# EAGLE design cms_intro (EAGLE 5.10)
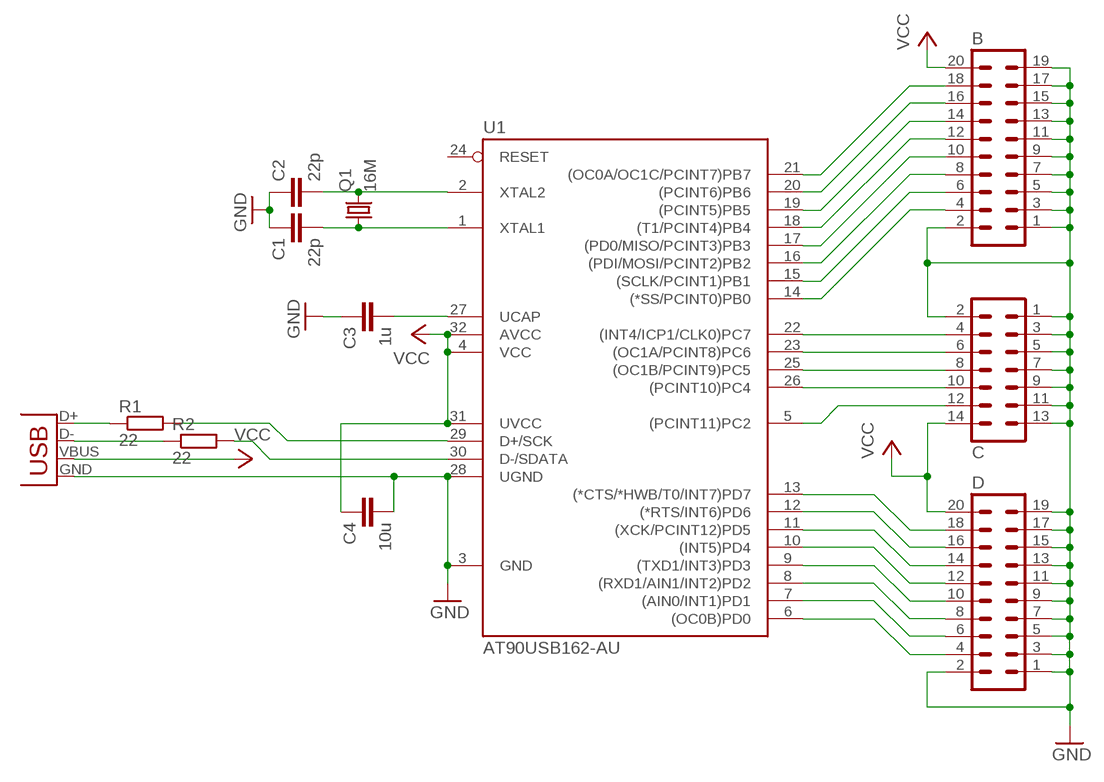
[diagram p0: schematic, sheet 1]

## Parts
B  MA10-2  [MA10-2]
C  MA07-2  [MA07-2]
C1  22p  C-EUC0603  [C0603]
C2  22p  C-EUC0603  [C0603]
C3  1u  C-EUC0603  [C0603]
C4  10u  C-EUC0603  [C0603]
D  MA10-2  [MA10-2]
Q1  16M  CRYSTALSM49  [SM49]
R1  22  R-EU_R0603  [R0603]
R2  22  R-EU_R0603  [R0603]
U1  AT90USB162-AU  [TQFP32-08]
X7  USB-MICROB-S  [USB-MICROB]

## Nets
B0: B.4 U1.14((*SS/PCINT0)PB0)
B1: B.6 U1.15((SCLK/PCINT1)PB1)
B2: B.8 U1.16((PDI/MOSI/PCINT2)PB2)
B3: B.10 U1.17((PD0/MISO/PCINT3)PB3)
B4: B.12 U1.18((T1/PCINT4)PB4)
B5: B.14 U1.19((PCINT5)PB5)
B6: B.16 U1.20((PCINT6)PB6)
B7: B.18 U1.21((OC0A/OC1C/PCINT7)PB7)
C2: C.12 U1.5((PCINT11)PC2)
C4: C.10 U1.26((PCINT10)PC4)
C5: C.8 U1.25((OC1B/PCINT9)PC5)
C6: C.6 U1.23((OC1A/PCINT8)PC6)
C7: C.4 U1.22((INT4/ICP1/CLK0)PC7)
D0: D.4 U1.6((OC0B)PD0)
D1: D.6 U1.7((AIN0/INT1)PD1)
D2: D.8 U1.8((RXD1/AIN1/INT2)PD2)
D3: D.10 U1.9((TXD1/INT3)PD3)
D4: D.12 U1.10((INT5)PD4)
D5: D.14 U1.11((XCK/PCINT12)PD5)
D6: D.16 U1.12((*RTS/INT6)PD6)
D7: D.18 U1.13((*CTS/*HWB/T0/INT7)PD7)
DM: R2.2 U1.30(D-/SDATA)
DMC: R2.1 X7.D-
DP: R1.2 U1.29(D+/SCK)
DPC: R1.1 X7.D+
GND [supply]: B.1 B.2 B.3 B.5 B.7 B.9 B.11 B.13 B.15 B.17 B.19 C1.1 C2.1 C3.1 C4.2 C.1 C.2 C.3 C.5 C.7 C.9 C.11 C.13 D.1 D.2 D.3 D.5 D.7 D.9 D.11 D.13 D.15 D.17 D.19 U1.3(GND) U1.28(UGND) X7.GND
UCAP: C3.2 U1.27(UCAP)
VCC [supply]: B.20 C4.1 C.14 D.20 U1.4(VCC) U1.31(UVCC) U1.32(AVCC) X7.VBUS
XTAL1: C1.2 Q1.1 U1.1(XTAL1)
XTAL2: C2.2 Q1.2 U1.2(XTAL2)
Unconnected: U1.24(RESET)

## Library data of the parts
B D = con-lstb:MA10-2: PIN HEADER
C = con-lstb:MA07-2: PIN HEADER
C1-C4 = rcl:C-EU: CAPACITOR, European symbol
Q1 = crystal:CRYSTAL: CRYSTAL
R1 R2 = rcl:R-EU_: RESISTOR, European symbol
U1 = at90usb:AT90USB162-*
X7 = apbteam_con-usb:USB: USB Connectors

## Net classes
1 supply: width 0.254 mm

## Board
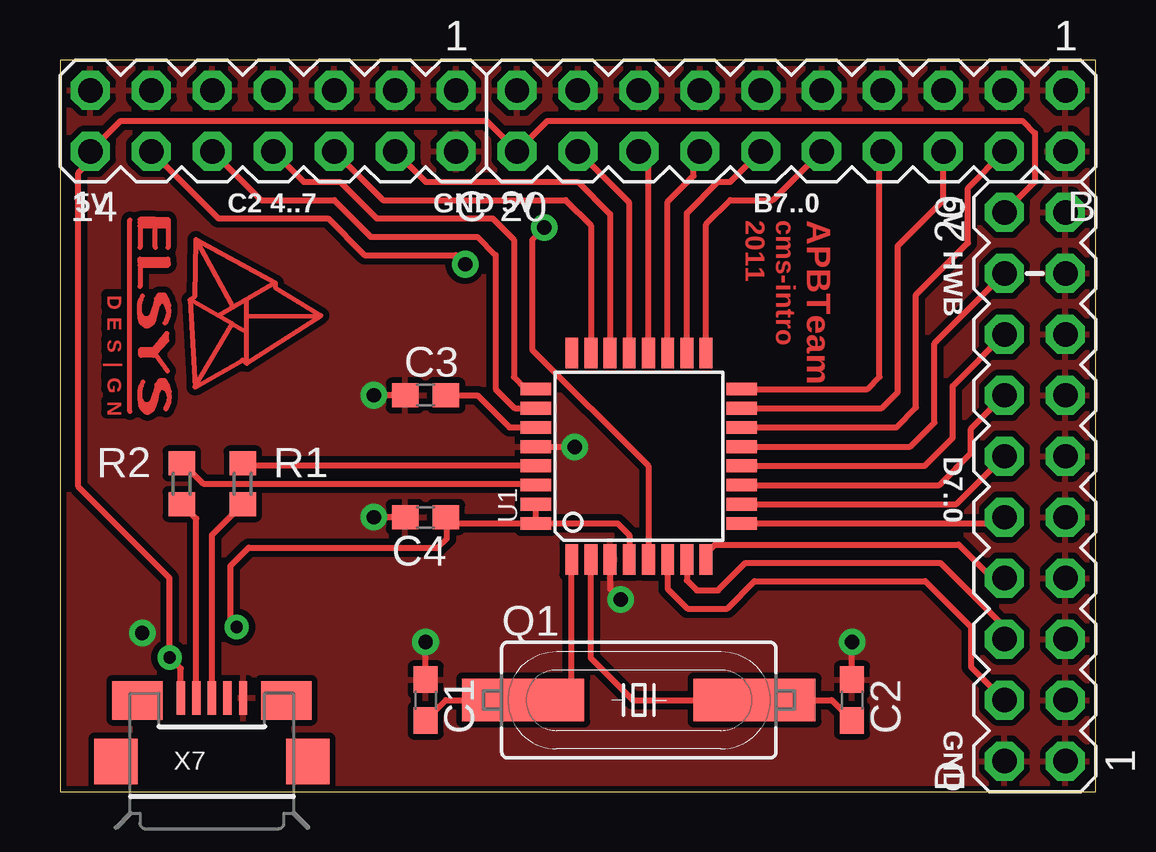
[diagram p1: board, top side]
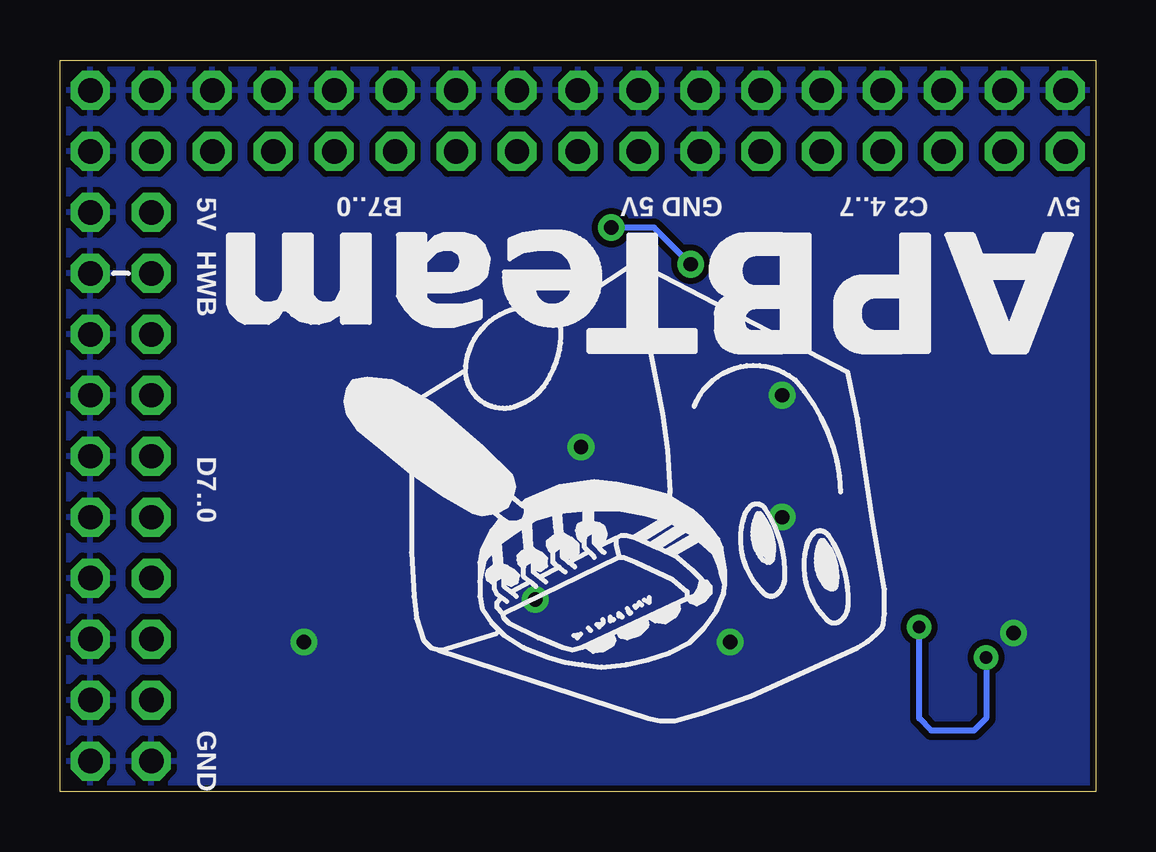
[diagram p2: board, bottom side, seen from below]

Size 43.18 x 30.48 mm. Coordinates in mm from the lower left corner, seen from the top.
Outline: 0,0 43.18,0 43.18,30.48 0,30.48 0,0
Copper layers (1*16): Top 0.035mm / dielectric 1.5mm / Bottom 0.035mm
Design rules "SparkFun *": minimum track width 6mil, minimum drill 20mil, track to track 6mil, track to pad 8mil, pad to pad 8mil, via to via 8mil, smd to smd 8mil, copper to edge 10mil, drill to drill 8mil, minimum pad ring 12mil, minimum via ring 10mil, stop-mask expansion 4mil, vias tented up to drill 25mil, thermal gap 10mil
tRestrict: area 3.3,0 to 9.4,2.7

### Footprints (pad centres in the part's own frame; a part is rotated, then mirrored left to right if it is on the bottom)
MA10-2 = drill 1.016 octagon: 1 -11.43,-1.27; 2 -11.43,1.27; 3 -8.89,-1.27; 4 -8.89,1.27; 5 -6.35,-1.27; 6 -6.35,1.27; 7 -3.81,-1.27; 8 -3.81,1.27; 9 -1.27,-1.27; 10 -1.27,1.27; 11 1.27,-1.27; 12 1.27,1.27; 13 3.81,-1.27; 14 3.81,1.27; 15 6.35,-1.27; 16 6.35,1.27; 17 8.89,-1.27; 18 8.89,1.27; 19 11.43,-1.27; 20 11.43,1.27
MA07-2 = drill 1.016 octagon: 1 -7.62,-1.27; 2 -7.62,1.27; 3 -5.08,-1.27; 4 -5.08,1.27; 5 -2.54,-1.27; 6 -2.54,1.27; 7 0,-1.27; 8 0,1.27; 9 2.54,-1.27; 10 2.54,1.27; 11 5.08,-1.27; 12 5.08,1.27; 13 7.62,-1.27; 14 7.62,1.27
C0603 = smd 1.1 x 1: 1 -0.85,0; 2 0.85,0
SM49 = smd 5.08 x 1.778: 1 -4.826,0; 2 4.826,0
R0603 = smd 1 x 1.1: 1 -0.85,0; 2 0.85,0
TQFP32-08 = smd 1.27 x 0.533: 1 -4.293,2.8; 2 -4.293,2; 3 -4.293,1.2; 4 -4.293,0.4; 5 -4.293,-0.4; 6 -4.293,-1.2; 7 -4.293,-2; 8 -4.293,-2.8; 17 4.293,-2.8; 18 4.293,-2; 19 4.293,-1.2; 20 4.293,-0.4; 21 4.293,0.4; 22 4.293,1.2; 23 4.293,2; 24 4.293,2.8 | smd 0.533 x 1.27: 9 -2.8,-4.293; 10 -2,-4.293; 11 -1.2,-4.293; 12 -0.4,-4.293; 13 0.4,-4.293; 14 1.2,-4.293; 15 2,-4.293; 16 2.8,-4.293; 25 2.8,4.293; 26 2,4.293; 27 1.2,4.293; 28 0.4,4.293; 29 -0.4,4.293; 30 -1.2,4.293; 31 -2,4.293; 32 -2.8,4.293
USB-MICROB = smd 0.35 x 1.4: D+ 0,2.65; D- -0.65,2.65; GND 1.3,2.65; ID 0.65,2.65; VBUS -1.3,2.65 | smd 1.8 x 1.9: MT1 -4,0; MT2 4,0 | smd 2.1 x 1.6: MT3 -3.1,2.55; MT4 3.1,2.55

### Placement (x,y rotation side)
B  30.48,27.94 180 top
C  8.89,27.94 180 top
C1  15.24,3.81 270 top
C2  33.02,3.81 270 top
C3  15.24,16.51 0 top
C4  15.24,11.43 180 top
D  40.64,12.7 90 top
Q1  24.13,3.81 0 top
R1  7.62,12.83 90 top
R2  5.08,12.83 90 top
U1  24.13,13.97 90 top
X7  6.33,1.25 0 top

### Tracks (layer width: path | path; a pad name or v marks a point on that pad's centre or on a via)
B0
  Top 0.254: U1.14 34.85,15.17 35.69,16 35.69,20.7 37.85,22.86 37.85,25.15 B.4
B1
  Top 0.254: U1.15 34.26,15.97 34.92,16.64 34.92,22.73 36.83,24.64 B.6
B2
  Top 0.254: U1.16 33.66,16.77 34.16,17.27 34.16,26.54 B.8
B3
  Top 0.254: U1.17 26.93,23.63 27.94,24.64 29.72,24.64 B.10
B4
  Top 0.254: U1.18 26.13,24.1 27.43,25.4 27.94,25.4 B.12
B5
  Top 0.254: U1.19 25.33,24.57 26.42,25.65 26.42,26.42 B.14
B6
  Top 0.254: U1.20 24.53,26.27 B.16
B7
  Top 0.254: U1.21 23.73,24.53 B.18
C2  (via drill 0.6)
  Top 0.254: U1.5 24.53,13.57 19.68,18.41 19.68,22.99 v20.19,23.5 | v16.89,21.97 16.51,22.35 12.7,22.35 11.18,23.88 6.6,23.88 C.12
  Bottom 0.254: v20.19,23.5 18.41,23.5 v16.89,21.97
C4
  Top 0.254: U1.26 18.95,15.97 18.16,16.76 18.16,22.35 17.4,23.11 12.95,23.11 11.43,24.64 8.38,24.64 C.10
C5
  Top 0.254: U1.25 19.43,16.77 18.92,17.27 18.92,22.99 18.03,23.88 13.21,23.88 11.68,25.4 10.16,25.4 C.8
C6
  Top 0.254: U1.23 22.13,23.59 21.08,24.64 13.46,24.64 C.6
C7
  Top 0.254: U1.22 22.93,24.06 21.59,25.4 15.24,25.4 C.4
D0
  Top 0.254: U1.6 25.33,8.45 26.16,7.62 27.81,7.62 28.96,8.76 36.07,8.76 37.97,6.86 37.97,5.21 D.4
D1
  Top 0.254: U1.7 26.13,8.79 26.54,8.38 27.43,8.38 28.57,9.53 36.7,9.53 39.37,6.86 D.6
D2
  Top 0.254: U1.8 26.93,9.91 27.3,10.29 37.47,10.29 38.86,8.89 D.8
D3
  Top 0.254: U1.9 39.11,11.17 D.10
D4
  Top 0.254: U1.10 37.37,11.97 D.12
D5
  Top 0.254: U1.11 36.65,12.77 37.97,14.1 37.97,15.11 D.14
D6
  Top 0.254: U1.12 36.05,13.57 37.21,14.73 37.21,16.89 D.16
D7
  Top 0.254: U1.13 35.45,14.37 36.45,15.37 36.45,18.67 D.18
DM
  Top 0.254: R2.2 5.12,13.68 5.97,12.83 19.78,12.83 U1.30
DMC
  Top 0.254: X7.D- 5.68,11.37 R2.1
DP
  Top 0.254: R1.2 7.79,13.68 7.87,13.59 19.82,13.59 U1.29
DPC
  Top 0.254: X7.D+ 6.33,10.69 R1.1
GND  (via drill 0.6)
  Top 0.254: C1.1 v15.24,6.22 | C2.1 v33.02,6.22 | U1.3 22.93,8.44 v23.37,8 | U1.28 21.44,14.37 v21.46,14.35 | C4.2 v13.08,11.43 | C3.1 v13.08,16.51
  other vias: 3.43,6.6
  pour Top (isolate 0.254): 0,30.48 43.18,30.48 43.18,0 0,0
  pour Bottom (isolate 0.254): 0,30.48 43.18,30.48 43.18,0 0,0
N$1
  Top 0.203: 8.98,21.2 6.64,19.85 | 5.68,23 8.98,21.2 | 8.98,21.2 8.98,20.99 10.88,19.82 | 7.79,17.84 7.79,19.8 | 7.79,19.8 7.79,20.51 | 7.79,17.84 10.88,19.82 | 7.79,17.84 7.61,17.97 5.63,16.85 5.42,20.48 | 7.18,19.49 7.76,19.16 | 7.18,19.49 5.42,20.48 | 5.42,20.48 5.63,20.64 5.68,23 | 5.68,23 7.23,20.18 | 7.79,19.8 10.88,19.82 | 5.63,16.88 7.18,19.49
N$2
  Top 0.203: 4.51,23.56 4.51,22.67 | 4.51,23.71 4.51,23.56 | 4.51,23.71 4.51,23.84 3.98,23.84 | 3.98,23.84 3.34,23.84 3.34,23.71 | 3.34,23.56 3.34,22.67 | 3.98,22.67 3.98,23.84 | 4.51,23.56 3.34,23.56 | 3.34,23.71 3.34,23.56 | 3.34,23.71 4.51,23.71
N$3
  Top 0.203: 3.34,22.06 3.34,22.19 4.51,22.19 4.51,22.06 | 3.34,21.93 3.34,21.04 | 4.51,22.06 4.51,21.93 3.34,21.93 | 3.34,22.06 3.34,21.93 | 3.34,22.06 4.51,22.06
N$4
  Top 0.203: 3.44,20.64 3.37,20.48 3.31,20.28 3.31,19.98 3.34,19.72 3.42,19.52 | 3.42,19.52 3.57,19.39 3.67,19.39 3.82,19.49 3.9,19.67 3.98,19.93 4.05,20.26 4.18,20.41 4.23,20.43 4.36,20.38 4.46,20.26 4.53,20.05 4.53,20 | 4.53,20 4.51,19.82 4.38,19.52 | 4.08,20.61 4.13,20.69 4.36,20.69 4.46,20.51 4.53,20.26 4.53,20 | 4.08,20.61 4.03,20.54 3.95,20.21 3.82,19.82 3.7,19.7 3.49,19.7 3.34,19.9 | 4.33,20.56 4.13,20.54 4.08,20.54 4.08,20.61 | 3.72,19.57 3.47,19.6 3.47,19.52 3.42,19.52 | 4.53,20
N$8
  Top 0.203: 3.97,18.25 4.46,18.78 4.46,19.09 3.9,18.43 3.37,18.43 3.37,18.17 3.9,18.17 | 3.9,18.17 3.97,18.25 | 4.48,17.51 4,18.17 3.9,18.17 | 3.44,18.3 3.92,18.27 3.97,18.27 3.97,18.25
N$11
  Top 0.203: 2.91,15.84 2.91,23.81
N$12
  Top 0.203: 3.47,17.06 3.39,16.9 3.34,16.7 3.34,16.4 3.37,16.14 3.44,15.94 | 3.44,15.94 3.59,15.81 3.7,15.81 3.85,15.91 3.92,16.09 4,16.34 4.08,16.68 4.2,16.83 4.25,16.85 4.38,16.8 4.48,16.68 4.56,16.47 | 4.56,16.47 4.53,16.24 4.41,15.94 | 4.56,16.47 4.56,16.42 | 4.05,16.95 4.15,17.11 4.38,17.11 4.48,16.93 4.56,16.68 4.56,16.47 | 4.05,16.95 3.98,16.62 3.85,16.24 3.72,16.12 3.52,16.12 3.37,16.32 | 4.36,16.98 4.15,16.95 4.05,16.95 | 3.75,15.99 3.49,16.02 3.44,16.02 3.44,15.94
UCAP
  Top 0.254: C3.2 17.4,16.51 18.74,15.17 U1.27
VCC  (via drill 0.51)
  Top 0.254: U1.32 U1.31 | U1.4 23.73,10.69 23.24,11.18 U1.32 | D.20 40.64,25.4 40.64,27.43 40.13,27.94 20.32,27.94 B.20 17.78,27.94 2.54,27.94 C.14 1.27,26.29 0.76,25.78 0.76,12.7 4.57,8.89 v4.57,5.59 5.04,5.12 X7.VBUS | U1.32 16.35,11.17 16.13,11.39 | 16.13,11.39 C4.1 | 16.13,11.39 16.13,10.54 15.75,10.16 7.87,10.16 7.11,9.4 7.11,7.11 v7.37,6.86
  Bottom 0.254: v7.37,6.86 7.37,3.05 6.86,2.54 5.08,2.54 4.57,3.05 v4.57,5.59
XTAL1
  Top 0.254: U1.1 21.33,3.82 21.34,3.81 Q1.1 16.09,3.81 C1.2
XTAL2
  Top 0.254: U1.2 22.13,5.56 23.88,3.81 Q1.2 32.17,3.81 C2.2

### Text on the board
Top: 2011 | cms-intro | APBTeam | D | E | S | | | G | N
tSilk: 5V | 5V | C2 4..7 | GND | 5V | B7..0 | HWB | D7..0 | GND
bSilk: 5V | C2 4..7 | GND | 5V | B7..0 | 5V | HWB | D7..0 | GND